# Altium project 28-RS485.PrjPcb
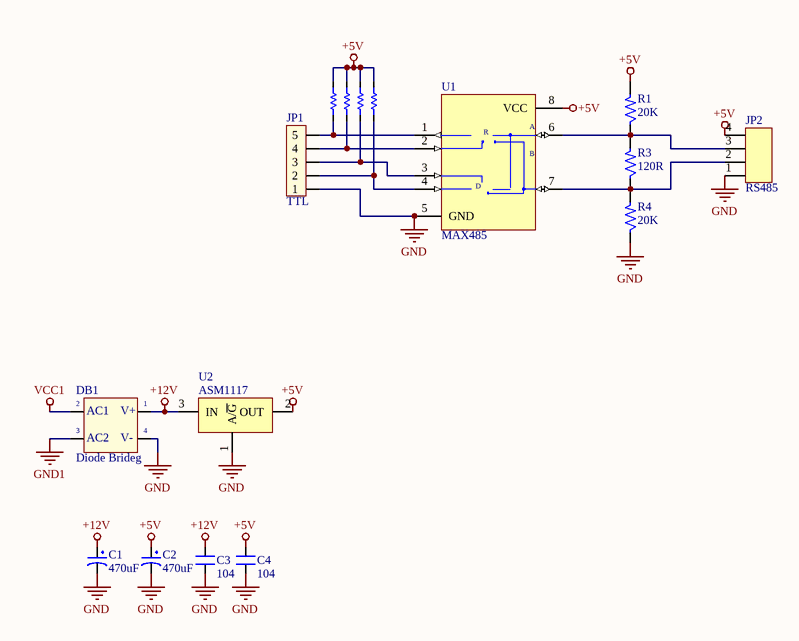
[diagram p0: 28-RS485.SchDoc]
1 sheet, 13 parts. Net scope: global (net labels, ports and power ports of the same name join across sheets).
Board file: 28-RS485.PcbDoc

## Sheet 28-RS485.SchDoc
size A

### Parts
C1  470uF  [C-ALU-D6.5]
C2  470uF  [C-ALU-D6.5]
C3  104  [C-0805]
C4  104  [C-0805]
DB1  Diode Brideg  [D-DB-1A-SMD]
JP1  TTL  [JP5]
JP2  RS485  [JP4]
R1  20K  [R-0805]
R2  10K  [R-Array-0603-4]  (value not drawn)  (parts A,B,C,D of 4)
R3  120R  [R-0805]
R4  20K  [R-0805]
U1  MAX485  [SOP-8]
U2  ASM1117  [TO-252]

### Nets
+5V: C2.1 C4.2 JP2.4 R1.2 R2.2 R2.4 R2.6 R2.8 U1.8(VCC) U2.2(OUT)
+12V: C1.1 C3.2 DB1.3(AC2) U2.3(IN)
GND: C1.2 C2.2 C3.1 C4.1 DB1.4(-V_OUT) JP1.1 JP2.1 R4.1 U1.5(GND) U2.1(A/~{G})
GND1: DB1.1(+V_OUT)
VCC1: DB1.2(AC1)
NetJP1_2: JP1.2 R2.1 U1.4(DI)
NetJP1_3: JP1.3 R2.7 U1.3(DE)
NetJP1_4: JP1.4 R2.5 U1.2(~{RE})
NetJP1_5: JP1.5 R2.3 U1.1(RO)
NetJP2_2: JP2.2 R3.1 R4.2 U1.7(B)
NetJP2_3: JP2.3 R1.1 R3.2 U1.6(A)

### Notes on the sheet
- (in symbol DB) V+; V-
- (in symbol MAX485) R; D

### Library data of the parts
C1 C2 = CP1: Cap P  0,1uF < 22uF , 16 - 50V; Value: 10uF/50V; Description 1: 10 => 220uF/6,3V/10V - 10uF => 100uF/16V; Description 2: 0,1uF => 33uF/50V - 10uF => 22uF/63V; Description 3: 0,47uF => 10uF/100V
C3 C4 = CN: Value: 0,1uF/300V; Designed by: VanDungEvn
DB1 = DB: Convert AC to DC voltage, 4 pin; Value: Cau 1A
JP1 = JP5
JP2 = JP4
R1 R3 R4 = R: Resistor 1/4W; Value: R1/4W - 1K
R2 = Res Array 4: RES ARRAY 4 RES 330 OHM 1206; Manufacturer: Panasonic Electronic Components; Manufacturer Part Number: EXB-38V331JV; Digi-Key Part Number: Y9331TR-ND; Link: http://www.digikey.com/product-detail/en/EXB-38V331JV/Y9331TR-ND/256525
U1 = MAX485: Value: MAX485